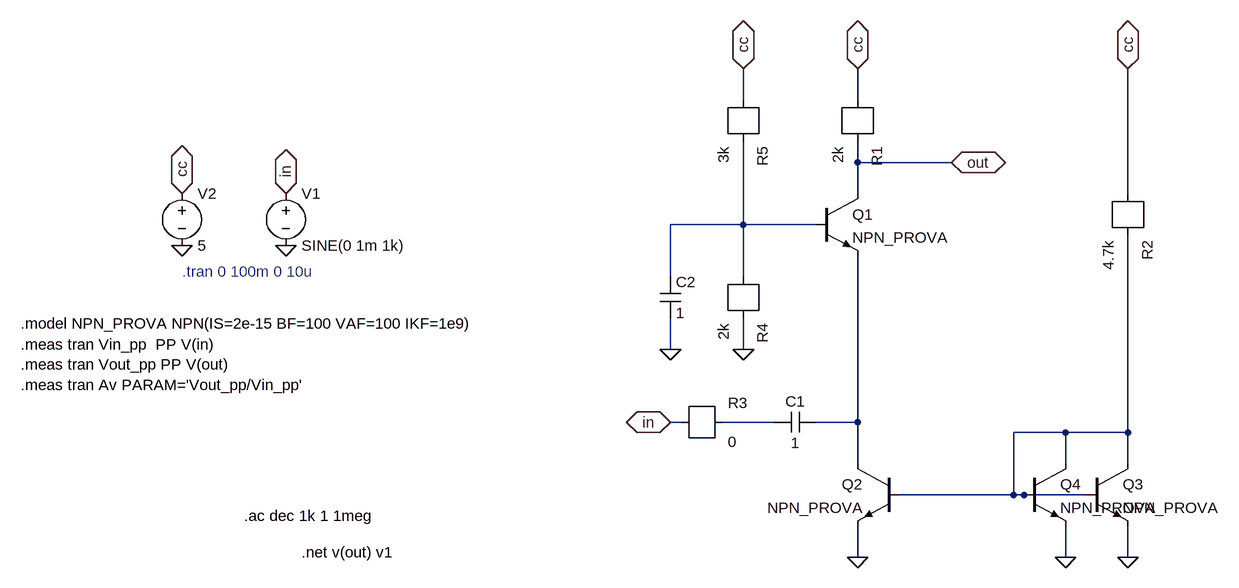
[diagram p0: schematic circuit_lt.asc]
circuit_lt.asc, the LTspice schematic file:
Version 4
SHEET 1 1268 696
WIRE 528 -32 528 -80
WIRE 704 -32 704 -80
WIRE 704 64 704 32
WIRE 848 64 704 64
WIRE 704 112 704 64
WIRE 1120 112 1120 -80
WIRE 528 160 528 32
WIRE 528 160 416 160
WIRE 640 160 528 160
WIRE 416 240 416 160
WIRE 528 240 528 160
WIRE 416 352 416 304
WIRE 528 352 528 304
WIRE 432 464 416 464
WIRE 576 464 496 464
WIRE 704 464 704 208
WIRE 704 464 640 464
WIRE 1024 480 944 480
WIRE 1120 480 1120 176
WIRE 1120 480 1024 480
WIRE 704 528 704 464
WIRE 1024 528 1024 480
WIRE 1120 528 1120 480
WIRE 944 576 944 480
WIRE 944 576 768 576
WIRE 960 576 944 576
WIRE 1056 576 960 576
WIRE 704 672 704 624
WIRE 1024 672 1024 624
WIRE 1120 672 1120 624
FLAG -336 192 0
FLAG -176 192 0
FLAG -336 112 cc
IOPIN -336 112 BiDir
FLAG -176 112 in
IOPIN -176 112 BiDir
FLAG 528 352 0
FLAG 528 -80 cc
IOPIN 528 -80 BiDir
FLAG 704 -80 cc
IOPIN 704 -80 BiDir
FLAG 848 64 out
IOPIN 848 64 BiDir
FLAG 416 352 0
FLAG 1120 -80 cc
IOPIN 1120 -80 BiDir
FLAG 704 672 0
FLAG 1120 672 0
FLAG 416 464 in
IOPIN 416 464 BiDir
FLAG 1024 672 0
SYMBOL voltage -176 96 R0
SYMATTR InstName V1
SYMATTR Value SINE(0 1m 1k)
SYMBOL voltage -336 96 R0
SYMATTR InstName V2
SYMATTR Value 5
SYMBOL npn 640 112 R0
SYMATTR InstName Q1
SYMATTR Value NPN_PROVA
SYMBOL r 704 -32 R90
SYMATTR InstName R1
SYMATTR Value 2k
SYMBOL r 528 240 R90
SYMATTR InstName R4
SYMATTR Value 2k
SYMBOL r 528 -32 R90
SYMATTR InstName R5
SYMATTR Value 3k
SYMBOL cap 400 240 R0
SYMATTR InstName C2
SYMATTR Value 1
SYMBOL npn 768 528 M0
SYMATTR InstName Q2
SYMATTR Value NPN_PROVA
SYMBOL npn 1056 528 R0
SYMATTR InstName Q3
SYMATTR Value NPN_PROVA
SYMBOL r 1120 112 R90
SYMATTR InstName R2
SYMATTR Value 4.7k
SYMBOL cap 640 448 R90
WINDOW 0 0 32 VBottom 2
WINDOW 3 32 32 VTop 2
SYMATTR InstName C1
SYMATTR Value 1
SYMBOL r 432 464 R0
SYMATTR InstName R3
SYMATTR Value 0
SYMBOL npn 960 528 R0
SYMATTR InstName Q4
SYMATTR Value NPN_PROVA
TEXT -584 312 Left 2 !.model NPN_PROVA NPN(IS=2e-15 BF=100 VAF=100 IKF=1e9)
TEXT -336 232 Left 2 ;.tran 0 100m 0 10u
TEXT -584 344 Left 2 !.meas tran Vin_pp  PP V(in)\n.meas tran Vout_pp PP V(out)\n.meas tran Av PARAM='Vout_pp/Vin_pp'
TEXT -240 608 Left 2 !.ac dec 1k 1 1meg
TEXT -152 664 Left 2 !.net v(out) v1

The netlist it stands for:
* circuit_lt.asc
V1 in 0 SINE(0 1m 1k)
V2 cc 0 5
Q1 out N001 N003 0 NPN_PROVA
R1 out cc 2k
R4 0 N001 2k
R5 N001 cc 3k
C2 N001 0 1
Q2 N003 N004 0 0 NPN_PROVA
Q3 N004 N004 0 0 NPN_PROVA
R2 N004 cc 4.7k
C1 N003 N002 1
R3 N002 in 0
Q4 N004 N004 0 0 NPN_PROVA
.model NPN NPN
.model PNP PNP
.lib standard.bjt
.model NPN_PROVA NPN(IS=2e-15 BF=100 VAF=100 IKF=1e9)
* .tran 0 100m 0 10u
.meas tran Vin_pp  PP V(in)
.meas tran Vout_pp PP V(out)
.meas tran Av PARAM='Vout_pp/Vin_pp'
.ac dec 1k 1 1meg
.net v(out) v1
.backanno
.end